# Altium project Motherboard.PrjPCB
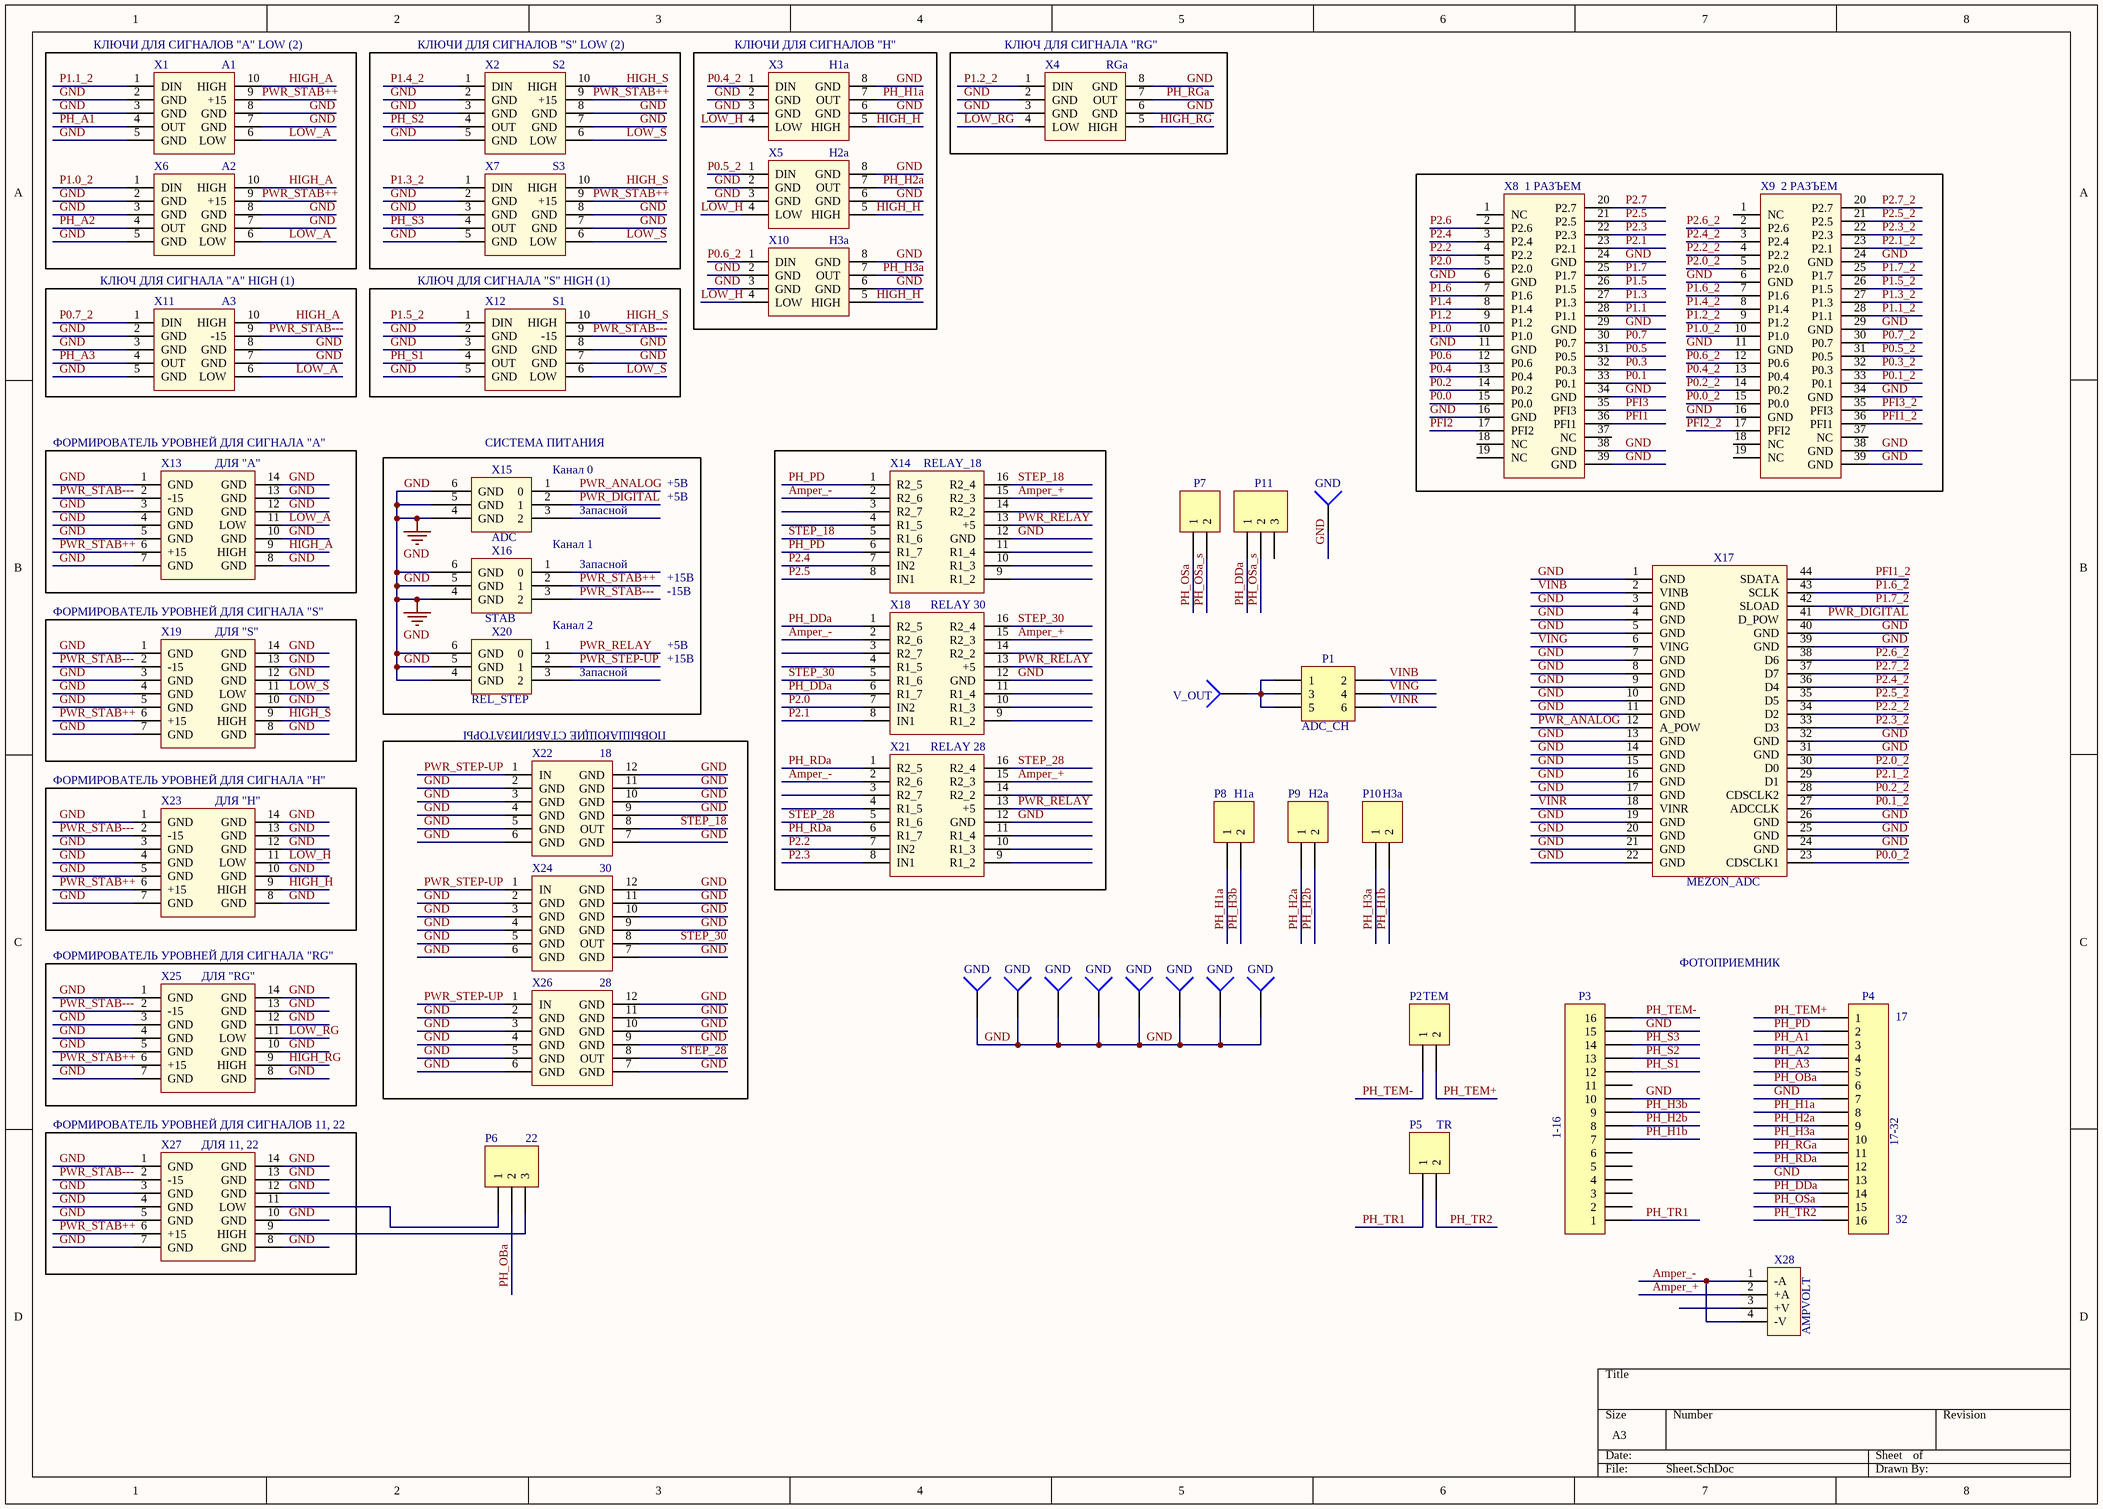
[diagram p0: Sheet.SchDoc]
1 sheet, 49 parts. Net scope: global (net labels, ports and power ports of the same name join across sheets).
Board file: Motherboard.PcbDoc

## Sheet Sheet.SchDoc
size A3

### Parts
J1  GND  [PIN1]
J2  GND  [PIN1]
J3  GND  [PIN1]
J4  GND  [PIN1]
J5  GND  [PIN1]
J6  GND  [PIN1]
J7  GND  [PIN1]
J8  GND  [PIN1]
J9  GND  [PIN1]
J10  V_OUT  [PIN1]
P1  ADC_CH  [HDR2X3]
P2  TEM  [HDR1X2]
P3  1-16  [HDR1X16]
P4  17-32  [HDR1X16]
P5  TR  [HDR1X2]
P6  22  [HDR1X3]
P7  (no value)  [HDR1X2]
P8  H1a  [HDR1X2]
P9  H2a  [HDR1X2]
P10  H3a  [HDR1X2]
P11  (no value)  [HDR1X3]
X1  A1  [MEZON_V]
X2  S2  [MEZON_V]
X3  H1a  [MEZON_H]
X4  RGa  [MEZON_H]
X5  H2a  [MEZON_H]
X6  A2  [MEZON_V]
X7  S3  [MEZON_V]
X8  1 РАЗЪЕМ  [CHEAP_CONN_FEMALE]
X9  2 РАЗЪЕМ  [CHEAP_CONN_FEMALE]
X10  H3a  [MEZON_H]
X11  A3  [MEZON_V]
X12  S1  [MEZON_V]
X13  ДЛЯ "А"  [MEZON_V+H]
X14  RELAY_18  [RELAY_MODULE]
X15  ADC  [POWER]
X16  STAB  [POWER]
X17  MEZON_ADC  [MEZON_ADC]
X18  RELAY 30  [RELAY_MODULE]
X19  ДЛЯ "S"  [MEZON_V+H]
X20  REL_STEP  [POWER]
X21  RELAY 28  [RELAY_MODULE]
X22  18  [MEZON_STEP-UP]
X23  ДЛЯ "H"  [MEZON_V+H]
X24  30  [MEZON_STEP-UP]
X25  ДЛЯ "RG"  [MEZON_V+H]
X26  28  [MEZON_STEP-UP]
X27  ДЛЯ 11, 22  [MEZON_V+H]
X28  AMPVOLT  [AMP_VOLTMETER]

### Blocks framed on the sheet
КЛЮЧИ ДЛЯ СИГНАЛОВ "А" LOW (2): X1 X6
КЛЮЧИ ДЛЯ СИГНАЛОВ "S" LOW (2): X2 X7
КЛЮЧИ ДЛЯ СИГНАЛОВ "H": X3 X5 X10
КЛЮЧ ДЛЯ СИГНАЛA "RG": X4
КЛЮЧ ДЛЯ СИГНАЛA "А" HIGH (1): X11
КЛЮЧ ДЛЯ СИГНАЛA "S" HIGH (1): X12
ФОРМИРОВАТЕЛЬ УРОВНЕЙ ДЛЯ СИГНАЛА "A": X13
ФОРМИРОВАТЕЛЬ УРОВНЕЙ ДЛЯ СИГНАЛА "S": X19
ПОВЫШАЮЩИЕ СТАБИЛИЗАТОРЫ: X22 X24 X26
ФОРМИРОВАТЕЛЬ УРОВНЕЙ ДЛЯ СИГНАЛА "H": X23
ФОРМИРОВАТЕЛЬ УРОВНЕЙ ДЛЯ СИГНАЛА "RG": X25
ФОРМИРОВАТЕЛЬ УРОВНЕЙ ДЛЯ СИГНАЛОВ 11, 22: X27

### Nets
GND: J1.1 J2.1 J3.1 J4.1 J5.1 J6.1 J7.1 J8.1 J9.1 P3.10 P3.15 P4.7 P4.13 X1.2(GND) X1.3(GND) X1.5(GND) X1.7(GND) X1.8(GND) X2.2(GND) X2.3(GND) X2.5(GND) X2.7(GND) X2.8(GND) X3.2(GND) X3.3(GND) X3.6(GND) X3.8(GND) X4.2(GND) X4.3(GND) X4.6(GND) X4.8(GND) X5.2(GND) X5.3(GND) X5.6(GND) X5.8(GND) X6.2(GND) X6.3(GND) X6.5(GND) X6.7(GND) X6.8(GND) X7.2(GND) X7.3(GND) X7.5(GND) X7.7(GND) X7.8(GND) X8.6(GND) X8.11(GND) X8.16(GND) X8.24(GND) X8.29(GND) X8.34(GND) X8.38(GND) X8.39(GND) X9.6(GND) X9.11(GND) X9.16(GND) X9.24(GND) X9.29(GND) X9.34(GND) X9.38(GND) X9.39(GND) X10.2(GND) X10.3(GND) X10.6(GND) X10.8(GND) X11.2(GND) X11.3(GND) X11.5(GND) X11.7(GND) X11.8(GND) X12.2(GND) X12.3(GND) X12.5(GND) X12.7(GND) X12.8(GND) X13.1(GND) X13.3(GND) X13.4(GND) X13.5(GND) X13.7(GND) X13.8(GND) X13.10(GND) X13.12(GND) X13.13(GND) X13.14(GND) X14.12(GND) X15.4(GND) X15.5(GND) X15.6(GND) X16.4(GND) X16.5(GND) X16.6(GND) X17.1(GND) X17.3(GND) X17.4(GND) X17.5(GND) X17.7(GND) X17.8(GND) X17.9(GND) X17.10(GND) X17.11(GND) X17.13(GND) X17.14(GND) X17.15(GND) X17.16(GND) X17.17(GND) X17.19(GND) X17.20(GND) X17.21(GND) X17.22(GND) X17.24(GND) X17.25(GND) X17.26(GND) X17.31(GND) X17.32(GND) X17.39(GND) X17.40(GND) X18.12(GND) X19.1(GND) X19.3(GND) X19.4(GND) X19.5(GND) X19.7(GND) X19.8(GND) X19.10(GND) X19.12(GND) X19.13(GND) X19.14(GND) X20.4(GND) X20.5(GND) X20.6(GND) X21.12(GND) X22.2(GND) X22.3(GND) X22.4(GND) X22.5(GND) X22.6(GND) X22.7(GND) X22.9(GND) X22.10(GND) X22.11(GND) X22.12(GND) X23.1(GND) X23.3(GND) X23.4(GND) X23.5(GND) X23.7(GND) X23.8(GND) X23.10(GND) X23.12(GND) X23.13(GND) X23.14(GND) X24.2(GND) X24.3(GND) X24.4(GND) X24.5(GND) X24.6(GND) X24.7(GND) X24.9(GND) X24.10(GND) X24.11(GND) X24.12(GND) X25.1(GND) X25.3(GND) X25.4(GND) X25.5(GND) X25.7(GND) X25.8(GND) X25.10(GND) X25.12(GND) X25.13(GND) X25.14(GND) X26.2(GND) X26.3(GND) X26.4(GND) X26.5(GND) X26.6(GND) X26.7(GND) X26.9(GND) X26.10(GND) X26.11(GND) X26.12(GND) X27.1(GND) X27.3(GND) X27.4(GND) X27.5(GND) X27.7(GND) X27.8(GND) X27.10(GND) X27.12(GND) X27.13(GND) X27.14(GND)
Amper_+: X14.15(R2_3) X18.15(R2_3) X21.15(R2_3) X28.2(+A)
Amper_-: X14.2(R2_6) X18.2(R2_6) X21.2(R2_6) X28.1(-A) X28.4(-V)
HIGH_A: X1.10(HIGH) X6.10(HIGH) X11.10(HIGH) X13.9(HIGH)
HIGH_H: X3.5(HIGH) X5.5(HIGH) X10.5(HIGH) X23.9(HIGH)
HIGH_RG: X4.5(HIGH) X25.9(HIGH)
HIGH_S: X2.10(HIGH) X7.10(HIGH) X12.10(HIGH) X19.9(HIGH)
LOW_A: X1.6(LOW) X6.6(LOW) X11.6(LOW) X13.11(LOW)
LOW_H: X3.4(LOW) X5.4(LOW) X10.4(LOW) X23.11(LOW)
LOW_RG: X4.4(LOW) X25.11(LOW)
LOW_S: X2.6(LOW) X7.6(LOW) X12.6(LOW) X19.11(LOW)
P0.0: X8.15(P0.0)
P0.0_2: X9.15(P0.0) X17.23(CDSCLK1)
P0.1: X8.33(P0.1)
P0.1_2: X9.33(P0.1) X17.27(ADCCLK)
P0.2: X8.14(P0.2)
P0.2_2: X9.14(P0.2) X17.28(CDSCLK2)
P0.3: X8.32(P0.3)
P0.3_2: X9.32(P0.3)
P0.4: X8.13(P0.4)
P0.4_2: X3.1(DIN) X9.13(P0.4)
P0.5: X8.31(P0.5)
P0.5_2: X5.1(DIN) X9.31(P0.5)
P0.6: X8.12(P0.6)
P0.6_2: X9.12(P0.6) X10.1(DIN)
P0.7: X8.30(P0.7)
P0.7_2: X9.30(P0.7) X11.1(DIN)
P1.0: X8.10(P1.0)
P1.0_2: X6.1(DIN) X9.10(P1.0)
P1.1: X8.28(P1.1)
P1.1_2: X1.1(DIN) X9.28(P1.1)
P1.2: X8.9(P1.2)
P1.2_2: X4.1(DIN) X9.9(P1.2)
P1.3: X8.27(P1.3)
P1.3_2: X7.1(DIN) X9.27(P1.3)
P1.4: X8.8(P1.4)
P1.4_2: X2.1(DIN) X9.8(P1.4)
P1.5: X8.26(P1.5)
P1.5_2: X9.26(P1.5) X12.1(DIN)
P1.6: X8.7(P1.6)
P1.6_2: X9.7(P1.6) X17.43(SCLK)
P1.7: X8.25(P1.7)
P1.7_2: X9.25(P1.7) X17.42(SLOAD)
P2.0: X8.5(P2.0) X18.7(IN2)
P2.0_2: X9.5(P2.0) X17.30(D0)
P2.1: X8.23(P2.1) X18.8(IN1)
P2.1_2: X9.23(P2.1) X17.29(D1)
P2.2: X8.4(P2.2) X21.7(IN2)
P2.2_2: X9.4(P2.2) X17.34(D2)
P2.3: X8.22(P2.3) X21.8(IN1)
P2.3_2: X9.22(P2.3) X17.33(D3)
P2.4: X8.3(P2.4) X14.7(IN2)
P2.4_2: X9.3(P2.4) X17.36(D4)
P2.5: X8.21(P2.5) X14.8(IN1)
P2.5_2: X9.21(P2.5) X17.35(D5)
P2.6: X8.2(P2.6)
P2.6_2: X9.2(P2.6) X17.38(D6)
P2.7: X8.20(P2.7)
P2.7_2: X9.20(P2.7) X17.37(D7)
PFI1: X8.36(PFI1)
PFI1_2: X9.36(PFI1) X17.44(SDATA)
PFI2: X8.17(PFI2)
PFI2_2: X9.17(PFI2)
PFI3: X8.35(PFI3)
PFI3_2: X9.35(PFI3)
PH_A1: P4.3 X1.4(OUT)
PH_A2: P4.4 X6.4(OUT)
PH_A3: P4.5 X11.4(OUT)
PH_DDa: P4.14 P11.1 X18.1(R2_5) X18.6(R1_7)
PH_H1a: P4.8 P8.1 X3.7(OUT)
PH_H1b: P3.7 P10.2
PH_H2a: P4.9 P9.1 X5.7(OUT)
PH_H2b: P3.8 P9.2
PH_H3a: P4.10 P10.1 X10.7(OUT)
PH_H3b: P3.9 P8.2
PH_OBa: P4.6 P6.2
PH_OSa: P4.15 P7.1
PH_OSa_s: P7.2 P11.2
PH_PD: P4.2 X14.1(R2_5) X14.6(R1_7)
PH_RDa: P4.12 X21.1(R2_5) X21.6(R1_7)
PH_RGa: P4.11 X4.7(OUT)
PH_S1: P3.12 X12.4(OUT)
PH_S2: P3.13 X2.4(OUT)
PH_S3: P3.14 X7.4(OUT)
PH_TEM+: P2.2 P4.1
PH_TEM-: P2.1 P3.16
PH_TR1: P3.1 P5.1
PH_TR2: P4.16 P5.2
PWR_ANALOG: X15.1(0) X17.12(A_POW)
PWR_DIGITAL: X15.2(1) X17.41(D_POW)
PWR_RELAY: X14.13(+5) X18.13(+5) X20.1(0) X21.13(+5)
PWR_STAB++: X1.9(+15) X2.9(+15) X6.9(+15) X7.9(+15) X13.6(+15) X16.2(1) X19.6(+15) X23.6(+15) X25.6(+15) X27.6(+15)
PWR_STAB---: X11.9(-15) X12.9(-15) X13.2(-15) X16.3(2) X19.2(-15) X23.2(-15) X25.2(-15) X27.2(-15)
PWR_STEP-UP: X20.2(1) X22.1(IN) X24.1(IN) X26.1(IN)
STEP_18: X14.5(R1_6) X14.16(R2_4) X22.8(OUT)
STEP_28: X21.5(R1_6) X21.16(R2_4) X26.8(OUT)
STEP_30: X18.5(R1_6) X18.16(R2_4) X24.8(OUT)
VINB: P1.2 X17.2(VINB)
VING: P1.4 X17.6(VING)
VINR: P1.6 X17.18(VINR)
NetJ10_1: J10.1 P1.1 P1.3 P1.5
NetP6_1: P6.1 X27.11(LOW)
NetP6_3: P6.3 X27.9(HIGH)

Not connected (* = marked no-connect by the designer): P3 2 3 4 5 6 11; P11 3; X8 1(NC) 18(NC) 19(NC) 37(NC); X9 1(NC) 18(NC) 19(NC) 37(NC); X14 3(R2_7) 4(R1_5) 9(R1_2) 10(R1_3) 11(R1_4) 14(R2_2); X15 3(2); X16 1(0); X18 3(R2_7) 4(R1_5) 9(R1_2) 10(R1_3) 11(R1_4) 14(R2_2); X20 3(2); X21 3(R2_7) 4(R1_5) 9(R1_2) 10(R1_3) 11(R1_4) 14(R2_2); X28 3(+V)

### Notes on the sheet
- СИСТЕМА ПИТАНИЯ
- (near X15) Канал 0
- Запасной
- +5В
- Канал 1
- +15В
- Канал 2
- -15В
- (near X20) Запасной
- ФОТОПРИЕМНИК
- (near P4) 17
- (near P4) 32

### Library data of the parts
J1-J10 = Socket: LatestRevisionDate: 17-Jul-2002; LatestRevisionNote: Re-released for DXP Platform.; Publisher: Altium Limited
P1 = Header 3X2: Header, 3-Pin, Dual row; LatestRevisionDate: 17-Jul-2002; LatestRevisionNote: Re-released for DXP Platform.; Publisher: Altium Limited
P2 P5 P7-P10 = Header 2: Header, 2-Pin; LatestRevisionDate: 17-Jul-2002; LatestRevisionNote: Re-released for DXP Platform.; Publisher: Altium Limited
P3 P4 = Header 16: Header, 16-Pin; LatestRevisionDate: 17-Jul-2002; LatestRevisionNote: Re-released for DXP Platform.; Publisher: Altium Limited
P6 P11 = Header 3: Header, 3-Pin; LatestRevisionDate: 17-Jul-2002; LatestRevisionNote: Re-released for DXP Platform.; Publisher: Altium Limited
X1 X2 X6 X7 = MEZON_V_+15
X3-X5 X10 = MEZON_H
X8 X9 = CHEAP_CON_37_FEMALE
X11 X12 = MEZON_V
X13 X19 X23 X25 X27 = MEZON_V+H
X14 X18 X21 = MEZON_RELAY
X15 X16 X20 = POWER
X22 X24 X26 = MEZON_STEP-UP
X28 = AMP_VOLTMETER